# Altium project MMC_2_4.PrjPcb
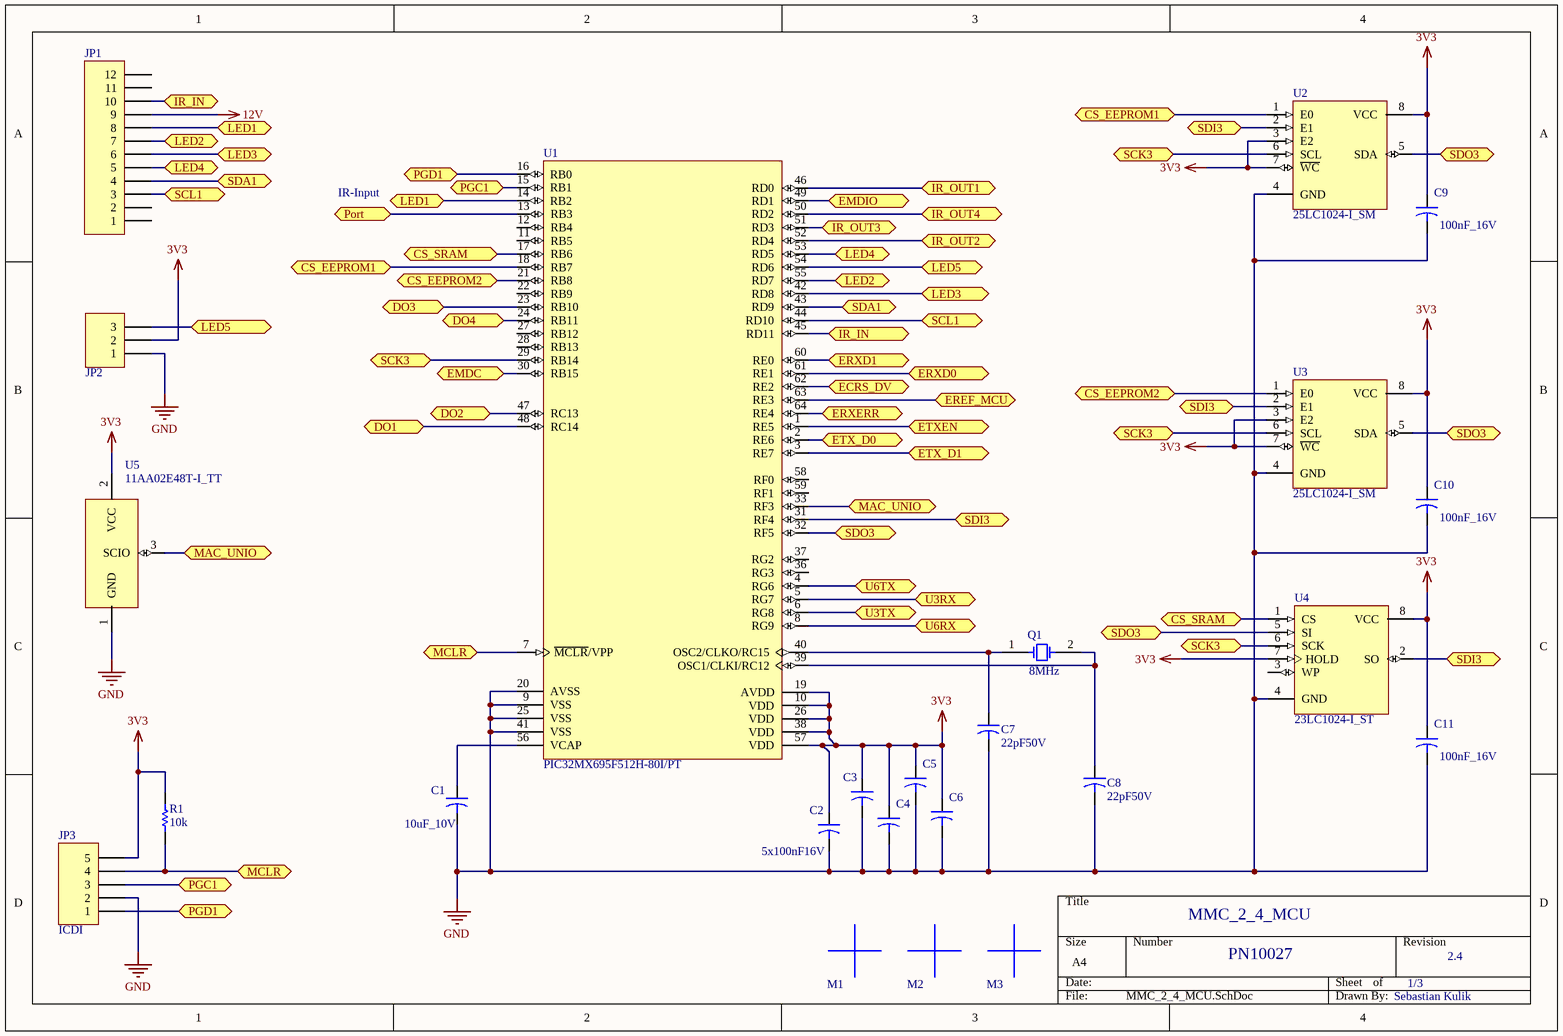
[diagram p0: MMC_2_4_MCU.SchDoc]
3 sheets, 99 parts. Net scope: flat (ports and power ports of the same name join across sheets).
Board file: MMC_2_4.PcbDoc
Sheets:
  MMC_2_4_MCU.SchDoc
  MMC_2_4_Ethernet.SchDoc
  MMC_2_4_PSU.SchDoc

## Sheet MMC_2_4_MCU.SchDoc
size A4

### Parts
C1  value 10uF_10V  [C0603]  (hidden comment: 10uF10V_0603)
C2  100nF16V_0402  [C0402]  (value not drawn)
C3  100nF16V_0402  [C0402]  (value not drawn)
C4  100nF16V_0402  [C0402]  (value not drawn)
C5  100nF16V_0402  [C0402]  (value not drawn)
C6  100nF16V_0402  [C0402]  (value not drawn)
C7  value 22pF50V  [C0402]  (hidden comment: 22pF50V_0402-AVX)
C8  value 22pF50V  [C0402]  (hidden comment: 22pF50V_0402-AVX)
C9  value 100nF_16V  [C0402]  (hidden comment: 100nF16V_0402)
C10  value 100nF_16V  [C0402]  (hidden comment: 100nF16V_0402)
C11  value 100nF_16V  [C0402]  (hidden comment: 100nF16V_0402)
JP1  Plug_12_2.54  [HDR1X12_2.54]  (value not drawn)
JP2  Header-3  [HDR1X3]  (value not drawn)
JP3  ICDI  [HDR1X5-1.27]
M1  Paste Mark  [Mark-3mm]  (value not drawn)
M2  Paste Mark  [Mark-3mm]  (value not drawn)
M3  Paste Mark  [Mark-3mm]  (value not drawn)
Q1  value 8MHz  [TXC_7A]  (hidden comment: Crystal_8MHz)
R1  value 10k  [R0402]  (hidden comment: 10k_0402)
U1  PIC32MX695F512H-80I/PT  [TQFP-64_N1]
U2  25LC1024-I_SM  [SOP8_N]
U3  25LC1024-I_SM  [SOP8_N]
U4  23LC1024-I_ST  [TSSOP8]
U5  11AA02E48T-I_TT  [SOT23_M]

### Ports
CS_EEPROM1, CS_EEPROM2, CS_SRAM, DO1, DO2, DO3, DO4, ECRS_DV, EMDC, EMDIO, EREF_MCU, ERXD0, ERXD1, ERXERR, ETX_D0, ETX_D1, ETXEN, IR_IN, IR_OUT1, IR_OUT2, IR_OUT3, IR_OUT4, LED1, LED2, LED3, LED4, LED5, MAC_UNIO, MCLR, PGC1, PGD1, Port, SCK3, SCL1, SDA1, SDI3, SDO3, U3RX, U3TX, U6RX, U6TX

### Nets
3V3: C2.1 C3.1 C4.1 C5.1 C6.1 C9.1 C10.1 C11.1 JP2.2 JP3.5 R1.2 U1.10(VDD) U1.19(AVDD) U1.26(VDD) U1.38(VDD) U1.57(VDD) U2.3(E2) U2.7(~{WC}) U2.8(VCC) U3.3(E2) U3.7(~{WC}) U3.8(VCC) U4.7(HOLD) U4.8(VCC) U5.2(VCC)
12V: JP1.9
GND: C1.2 C2.2 C3.2 C4.2 C5.2 C6.2 C7.2 C8.2 C9.2 C10.2 C11.2 JP2.1 JP3.2 U1.9(VSS) U1.20(AVSS) U1.25(VSS) U1.41(VSS) U2.4(GND) U3.4(GND) U4.4(GND) U5.1(GND)
NetC1_1: C1.1 U1.56(VCAP)
NetC7_1: C7.1 Q1.1 U1.40(OSC2/CLKO/RC15)
NetC8_1: C8.1 Q1.2 U1.39(OSC1/CLKI/RC12)
NetJP1_3: JP1.3 U1.44(RD10) ; port SCL1
NetJP1_4: JP1.4 U1.43(RD9) ; port SDA1
NetJP1_5: JP1.5 U1.53(RD5) ; port LED4
NetJP1_6: JP1.6 U1.42(RD8) ; port LED3
NetJP1_7: JP1.7 U1.55(RD7) ; port LED2
NetJP1_8: JP1.8 U1.14(RB2) ; port LED1
NetJP1_10: JP1.10 U1.45(RD11) ; port IR_IN
NetJP2_3: JP2.3 U1.54(RD6) ; port LED5
NetJP3_1: JP3.1 U1.16(RB0) ; port PGD1
NetJP3_3: JP3.3 U1.15(RB1) ; port PGC1
NetJP3_4: JP3.4 R1.1 U1.7(~{MCLR}/VPP) ; port MCLR
NetL5_2: U1.63(RE3) ; port EREF_MCU
NetR13_1: U1.49(RD1) ; port EMDIO
NetR15_2: U1.60(RE0) ; port ERXD1
NetR16_2: U1.61(RE1) ; port ERXD0
NetR17_2: U1.64(RE4) ; port ERXERR
NetR18_2: U1.62(RE2) ; port ECRS_DV
NetU1_1: U1.1(RE5) ; port ETXEN
NetU1_2: U1.2(RE6) ; port ETX_D0
NetU1_3: U1.3(RE7) ; port ETX_D1
NetU1_4: U1.4(RG6) ; port U6TX
NetU1_5: U1.5(RG7) ; port U3RX
NetU1_6: U1.6(RG8) ; port U3TX
NetU1_8: U1.8(RG9) ; port U6RX
NetU1_13: U1.13(RB3) ; port Port
NetU1_17: U1.17(RB6) U4.1(CS) ; port CS_SRAM
NetU1_18: U1.18(RB7) U2.1(E0) ; port CS_EEPROM1
NetU1_21: U1.21(RB8) U3.1(E0) ; port CS_EEPROM2
NetU1_23: U1.23(RB10) ; port DO3
NetU1_24: U1.24(RB11) ; port DO4
NetU1_29: U1.29(RB14) U2.6(SCL) U3.6(SCL) U4.6(SCK) ; port SCK3
NetU1_30: U1.30(RB15) ; port EMDC
NetU1_31: U1.31(RF4) U2.2(E1) U3.2(E1) U4.2(SO) ; port SDI3
NetU1_32: U1.32(RF5) U2.5(SDA) U3.5(SDA) U4.5(SI) ; port SDO3
NetU1_33: U1.33(RF3) U5.3(SCIO) ; port MAC_UNIO
NetU1_46: U1.46(RD0) ; port IR_OUT1
NetU1_47: U1.47(RC13) ; port DO2
NetU1_48: U1.48(RC14) ; port DO1
NetU1_50: U1.50(RD2) ; port IR_OUT4
NetU1_51: U1.51(RD3) ; port IR_OUT3
NetU1_52: U1.52(RD4) ; port IR_OUT2

Not connected (* = marked no-connect by the designer): JP1 1 2 11 12; U1 11(RB5) 12(RB4) 22(RB9) 27(RB12) 28(RB13) 36(RG3) 37(RG2) 58(RF0) 59(RF1); U4 3(WP)

### Notes on the sheet
- IR-Input
- (near C2) 5x100nF16V
- MMC_2_4_MCU
- PN10027
- 1/3
- 2.4
- Sebastian Kulik

### Library data of the parts
C1 = 10uF10V_0603: AVX ,  X5R, 20%, 10V; Deliverer PartNr: 1867954RL; Manufacturer PartNr: 0603ZD106MAT2A; Deliverer: Farnell; TDE-PN: C0016; Published: 11.02.2014; Part Description: AVX ,  X5R, 20%, 10V; Publisher: Sebastian Kulik; PackageDescription: C0603; Manufacturer: AVX
C2-C6 = 100nF16V_0402: TDK. CGA series, X7R, 10%, 16V; Deliverer PartNr: 2366533; Manufacturer: TDK; Manufacturer PartNr: CGA2B1X7R1C104K050BC; Deliverer: Farnell; Value: 100nF_16V; TDE-PN: C0025; Published: 12.02.2014; Part Description: TDK. CGA series, X7R, 10%, 16V; Publisher: Sebastian Kulik; PackageDescription: C0402
C7 C8 = 22pF50V_0402-AVX: AVX, 50V; Deliverer PartNr: 2332500; Manufacturer PartNr: 04025A220FAT2A; Deliverer: Farnell; TDE-PN: C0021; Published: 22.10.2014; Part Description: AVX, 50V; Publisher: Sebastian Kulik; PackageDescription: C0402; Manufacturer: AVX
C9-C11 = 100nF16V_0402: TDK. CGA series, X7R, 10%, 16V; Deliverer PartNr: 2366533; Manufacturer: TDK; Manufacturer PartNr: CGA2B1X7R1C104K050BC; Deliverer: Farnell; TDE-PN: C0025; Published: 12.02.2014; Part Description: TDK. CGA series, X7R, 10%, 16V; Publisher: Sebastian Kulik; PackageDescription: C0402
JP1 = Plug_12_2.54: Plug, 11-Pin; Manufacturer PartNr: 61301211121; Manufacturer: WE; TDE-PN: CON0018; LatestRevisionDate: 27.05.2014; LatestRevisionNote: Re-released for DXP Platform.; Publisher: Sebastian Kulik; Deliverer: WE; Deliverer PartNr: 61301211121
JP2 = Header-3: Header-3-Pin; Publisher: Sebastian Kulik
JP3 = ICDI: Header, 5-Pin; LatestRevisionDate: 17-Jul-2002; LatestRevisionNote: Re-released for DXP Platform.; Publisher: Sebastian Kulik; PackageDescription: HDR1X1.27
M1-M3 = Mark: Comment_1: PasteMark
Q1 = Crystal_8MHz: Crystal, 7A-8.000MAAJ-T; Deliverer PartNr: 1892148; Manufacturer: TXC; Deliverer: Farnell; TDE-PN: P0003; Published: 14.02.2014; Publisher: Sebastian Kulik; Manufacturer PartNr: 7A-8.000MAAJ-T; PackageDescription: TXC_7A
R1 = 10k_0402: Vishay CRCW series, 125mW, 1%; Manufacturer PartNr: CRCW040210K0FKEAHP; Deliverer PartNr: 1738864; TDE-PN: R0012; Deliverer: Farnell; Published: 12.02.2014; Publisher: Sebastian Kulik; PackageDescription: 0402; Manufacturer: Vishay; Part Description: Vishay CRCW series, 125mW, 1%
U1 = PIC32MX695F512H-80I/PT: High Performance ROM-less Microcontroller with External Memory Bus, 1.5K RAM, 64-Pin TQFP, 4.2 to 5.5V Supply Range, Industrial Temperature; Deliverer PartNr: 1778975; Manufacturer: Microchip; Deliverer: Farnell; TDE-PN: IC0031; Published: 11.02.2014; PackageReference: TQFP-64; Publisher: Sebastian Kulik; PackageDescription: 64-Pin Thin Plastic Quad Flat Pack 0.5 mm Pitch, 1.0/0.1 mm Lead Form; Manufacturer PartNr: PIC32MX695F512H-80I/PT
U2 U3 = 25LC1024-I_SM: 1024 Kbit Serial SPI Bus EEPROM; Deliverer PartNr: 1331393; Manufacturer: Microchip; Deliverer: Farnell; TDE-PN: IC0033; Published: 12.02.2014; Publisher: Sebastian Kulik; Manufacturer PartNr: 25LC1024-I_SM; PackageDescription: SOP8
U4 = 23LC1024-I_ST: 1 Mbit Serial  EEPROM; Deliverer PartNr: 2212151; Manufacturer PartNr: 23LC1024-I/ST; Manufacturer: Microchip; Deliverer: Farnell; TDE-PN: IC0034; Published: 12.02.2014; Publisher: Sebastian Kulik; PackageDescription: TSSOP8
U5 = 11AA02E48T-I_TT: 2 kbit Serial  EEPROM; Deliverer PartNr: 1707616RL; Manufacturer PartNr: 11AA02E48T-I/TT; Manufacturer: Microchip; Deliverer: Farnell; TDE-PN: IC0035; Published: 12.02.2014; Publisher: Sebastian Kulik; PackageDescription: SOT23

## Sheet MMC_2_4_Ethernet.SchDoc
size A4
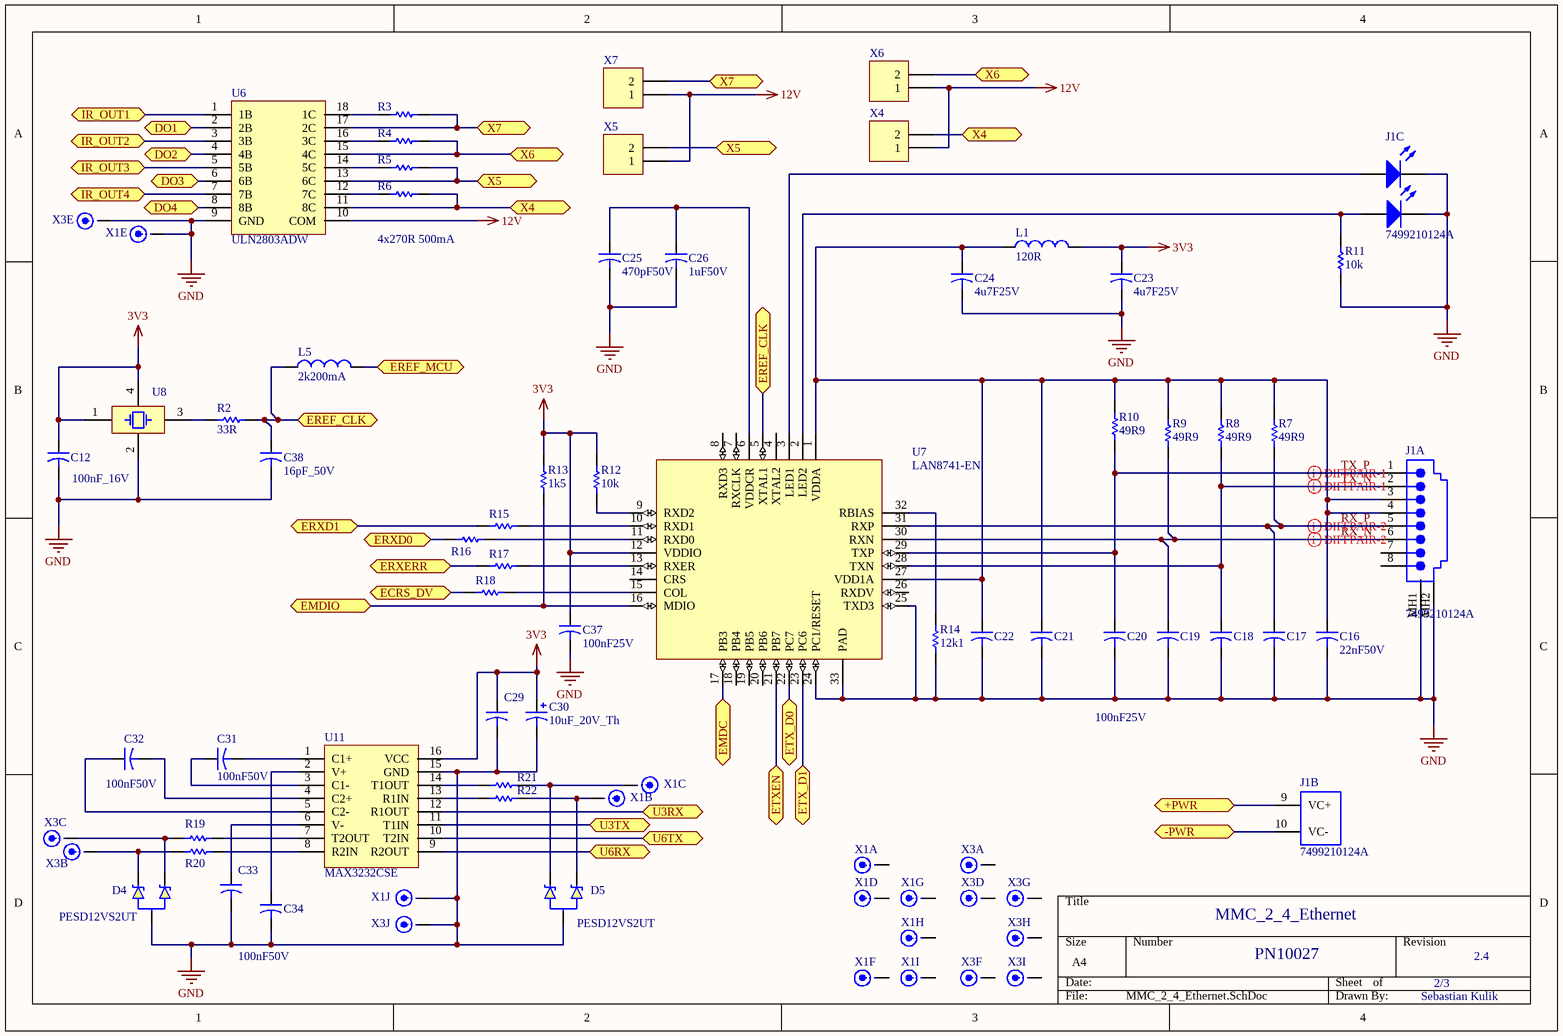
[diagram p1: MMC_2_4_Ethernet.SchDoc]

### Parts
C12  value 100nF_16V  [C0402]  (hidden comment: 100nF16V_0402)
C16  value 22nF50V  [C0603]  (hidden comment: 22nF50V_0603)
C17  10pF50V_0603  [C0603]  (value not drawn)
C18  10pF50V_0603  [C0603]  (value not drawn)
C19  10pF50V_0603  [C0603]  (value not drawn)
C20  10pF50V_0603  [C0603]  (value not drawn)
C21  value 100nF25V  [C0402]  (hidden comment: 100nF25V_0402)
C22  100nF25V_0402  [C0402]  (value not drawn)
C23  value 4u7F25V  [C0805]  (hidden comment: 4u7F25V_0805)
C24  value 4u7F25V  [C0805]  (hidden comment: 4u7F25V_0805)
C25  value 470pF50V  [C0402]  (hidden comment: 470pF50V_0402)
C26  value 1uF50V  [C0603]  (hidden comment: 1uF50V_0603)
C29  100nF25V_0402  [C0402]  (value not drawn)
C30  value 10uF_20V_Th  [Vishay293D-B]  (hidden comment: 10uF_20V_V293D-B)
C31  value 100nF50V  [C0402]  (hidden comment: 100n50V_0402)
C32  value 100nF50V  [C0402]  (hidden comment: 100n50V_0402)
C33  100n50V_0402  [C0402]  (value not drawn)
C34  value 100nF50V  [C0402]  (hidden comment: 100n50V_0402)
C37  value 100nF25V  [C0402]  (hidden comment: 100nF25V_0402)
C38  value 16pF_50V  [C0402]  (hidden comment: 16pF50V_0402)
D4  PESD12VS2UT  [SOT23_N]
D5  PESD12VS2UT  [SOT23_N]
J1  7499210124A  [7499210124A]  (parts A,B,C of 3)
L1  value 120R  [L0603]  (hidden comment: 120R4A_0603)
L5  value 2k200mA  [L0805_M]  (hidden comment: 2k200mA_0805)
R2  value 33R  [R0402]  (hidden comment: 33R_0402)
R3  270R_1210  [R1210_N]  (value not drawn)
R4  270R_1210  [R1210_N]  (value not drawn)
R5  270R_1210  [R1210_N]  (value not drawn)
R6  270R_1210  [R1210_N]  (value not drawn)
R7  value 49R9  [R0402]  (hidden comment: 49R9_0402)
R8  value 49R9  [R0402]  (hidden comment: 49R9_0402)
R9  value 49R9  [R0402]  (hidden comment: 49R9_0402)
R10  value 49R9  [R0402]  (hidden comment: 49R9_0402)
R11  value 10k  [R0402]  (hidden comment: 10k_0402)
R12  value 10k  [R0402]  (hidden comment: 10k_0402)
R13  value 1k5  [R0402]  (hidden comment: 1k5_0402)
R14  value 12k1  [R0603(1608)]  (hidden comment: 12k1_0603)
R15  10R_0402  [R0402]  (value not drawn)
R16  10R_0402  [R0402]  (value not drawn)
R17  10R_0402  [R0402]  (value not drawn)
R18  10R_0402  [R0402]  (value not drawn)
R19  10R_0402  [R0402]  (value not drawn)
R20  10R_0402  [R0402]  (value not drawn)
R21  10R_0402  [R0402]  (value not drawn)
R22  10R_0402  [R0402]  (value not drawn)
U6  ULN2803ADW  [SOIC18-WIDE]
U7  LAN8741-EN  [32M1-A_M]
U8  SG - 211 S*E -50.000M  [SG - 211 S*E]  (value not drawn)
U11  MAX3232CSE  [SOIC16_L]
X1  SUB-D_9  [M09HP]  (value not drawn)  (parts A,B,C,D,E,F,G,H,I,J of 10)
X3  SUB-D_9  [M09HP]  (value not drawn)  (parts A,B,C,D,E,F,G,H,I,J of 10)
X4  WR-TBL3127  [WR-TBL-3127]  (value not drawn)
X5  WR-TBL3127  [WR-TBL-3127]  (value not drawn)
X6  WR-TBL3127  [WR-TBL-3127]  (value not drawn)
X7  WR-TBL3127  [WR-TBL-3127]  (value not drawn)

### Ports
+PWR, -PWR, DO1, DO2, DO3, DO4, ECRS_DV, EMDC, EMDIO, EREF_CLK, EREF_MCU, ERXD0, ERXD1, ERXERR, ETX_D0, ETX_D1, ETXEN, IR_OUT1, IR_OUT2, IR_OUT3, IR_OUT4, U3RX, U3TX, U6RX, U6TX, X4, X5, X6, X7

### Nets
3V3: C12.1 C23.1 C29.1 C30.1 C37.1 L1.2 R12.2 R13.2 U7.12(VDDIO) U8.1(E/D) U8.4(VCC) U11.16(VCC)
12V: U6.10(COM) X4.1 X5.1 X6.1 X7.1
GND: C12.2 C16.2 C17.2 C18.2 C19.2 C20.2 C21.2 C22.2 C23.2 C24.2 C25.2 C26.2 C29.2 C30.2 C33.2 C34.2 C37.2 C38.2 D4.1(A) D5.1(A) J1.11(K) J1.13(K) J1.MH1(Shield) J1.MH2(Shield) R11.1 R14.1 U6.9(GND) U7.24(PC1/RESET) U7.25(TXD3) U7.33(PAD) U8.2(GND) U11.15(GND) X1.5 X1.10(GND) X3.5 X3.10(GND)
RX_N: C19.1 J1.6 R9.1 U7.30(RXN)
RX_P: C17.1 J1.5 R7.1 U7.31(RXP)
TX_N: C18.1 J1.2 R8.1 U7.28(TXN)
TX_P: C20.1 J1.1 R10.1 U7.29(TXP)
NetC16_1: C16.1 C21.1 C22.1 C24.1 J1.3 J1.4 L1.1 R7.2 R8.2 R9.2 R10.2 U7.1(VDDA) U7.27(VDD1A)
NetC25_1: C25.1 C26.1 U7.6(VDDCR)
NetC31_1: C31.1 U11.3(C1-)
NetC31_2: C31.2 U11.1(C1+)
NetC32_1: C32.1 U11.5(C2-)
NetC32_2: C32.2 U11.4(C2+)
NetC33_1: C33.1 U11.6(V-)
NetC34_1: C34.1 U11.2(V+)
NetC38_1: C38.1 L5.1 R2.2 U7.5(XTAL1) ; port EREF_CLK
NetD4_2: D4.2(K2) R20.1 X3.2
NetD4_3: D4.3(K1) R19.1 X3.3
NetD5_2: D5.2(K2) R21.2 X1.3
NetD5_3: D5.3(K1) R22.2 X1.2
NetJ1_9: J1.9(VC+) ; port +PWR
NetJ1_10: J1.10(VC-) ; port -PWR
NetJ1_12: J1.12(A) U7.3(LED1)
NetJ1_14: J1.14(A) R11.2 U7.2(LED2)
NetL5_2: L5.2 ; port EREF_MCU
NetR2_1: R2.1 U8.3(OSC2)
NetR3_1: R3.1 U6.18(1C)
NetR3_2: R3.2 U6.17(2C) X7.2 ; port X7
NetR4_1: R4.1 U6.16(3C)
NetR4_2: R4.2 U6.15(4C) X6.2 ; port X6
NetR5_1: R5.1 U6.14(5C)
NetR5_2: R5.2 U6.13(6C) X5.2 ; port X5
NetR6_1: R6.1 U6.12(7C)
NetR6_2: R6.2 U6.11(8C) X4.2 ; port X4
NetR12_1: R12.1 U7.9(RXD2)
NetR13_1: R13.1 U7.16(MDIO) ; port EMDIO
NetR14_2: R14.2 U7.32(RBIAS)
NetR15_1: R15.1 U7.10(RXD1)
NetR15_2: R15.2 ; port ERXD1
NetR16_1: R16.1 U7.11(RXD0)
NetR16_2: R16.2 ; port ERXD0
NetR17_1: R17.1 U7.13(RXER)
NetR17_2: R17.2 ; port ERXERR
NetR18_1: R18.1 U7.15(COL)
NetR18_2: R18.2 ; port ECRS_DV
NetR19_2: R19.2 U11.7(T2OUT)
NetR20_2: R20.2 U11.8(R2IN)
NetR21_1: R21.1 U11.14(T1OUT)
NetR22_1: R22.1 U11.13(R1IN)
NetU1_1: U7.21(PB7) ; port ETXEN
NetU1_2: U7.22(PC7) ; port ETX_D0
NetU1_3: U7.23(PC6) ; port ETX_D1
NetU1_4: U11.10(T2IN) ; port U6TX
NetU1_5: U11.12(R1OUT) ; port U3RX
NetU1_6: U11.11(T1IN) ; port U3TX
NetU1_8: U11.9(R2OUT) ; port U6RX
NetU1_23: U6.6(6B) ; port DO3
NetU1_24: U6.8(8B) ; port DO4
NetU1_30: U7.17(PB3) ; port EMDC
NetU1_46: U6.1(1B) ; port IR_OUT1
NetU1_47: U6.4(4B) ; port DO2
NetU1_48: U6.2(2B) ; port DO1
NetU1_50: U6.7(7B) ; port IR_OUT4
NetU1_51: U6.5(5B) ; port IR_OUT3
NetU1_52: U6.3(3B) ; port IR_OUT2

Not connected (* = marked no-connect by the designer): J1 7 8; U7 4(XTAL2) 7(RXCLK) 8(RXD3) 14(CRS) 18(PB4) 19(PB5) 20(PB6) 26(RXDV); X1 1 4 6 7 8 9; X3 1 4 6 7 8 9

### Layout directives
differential pair: RX_N, RX_P, TX_N, TX_P

### Notes on the sheet
- 4x270R 500mA
- MMC_2_4_Ethernet
- PN10027
- 2/3
- 2.4
- Sebastian Kulik

### Library data of the parts
C12 = 100nF16V_0402: as C9 on sheet MMC_2_4_MCU; Published: 12.02.2014; Part Description: TDK. CGA series, X7R, 10%, 16V; Publisher: Sebastian Kulik; PackageDescription: C0402
C16 = 22nF50V_0603: AVX ,  X7R, 5%, 50V; Deliverer PartNr: 1835412; Manufacturer PartNr: 06035C223JAT2A; Deliverer: Farnell; TDE-PN: C0034; Published: 13.02.2014; Part Description: AVX ,  X7R, 5%, 50V; Publisher: Sebastian Kulik; PackageDescription: C0603; Manufacturer: AVX
C17-C20 = 10pF50V_0603: AVX ,  +-0.5pF, 50V; Deliverer PartNr: 2332595RL; Manufacturer PartNr: 06035A100DAT2A; Deliverer: Farnell; TDE-PN: C0033; Published: 13.02.2014; Part Description: AVX ,  +-0.5pF, 50V; Publisher: Sebastian Kulik; PackageDescription: C0603; Manufacturer: AVX; Value: 10pF50V
C21 C22 C29 C37 = 100nF25V_0402: AVX, X5R, 10%, 25V; Deliverer PartNr: 1833862; Manufacturer PartNr: 04023D104KAT2A; Deliverer: Farnell; TDE-PN: C0036; Published: 09.12.2014; Part Description: AVX, X5R, 10%, 25V; Publisher: Sebastian Kulik; PackageDescription: C0402; Manufacturer: AVX
  C22 C29: Value: 100nF25V
C23 C24 = 4u7F25V_0805: TDK  C series, X7R, 10%, 25V; Deliverer PartNr: 2346943RL; Manufacturer PartNr: C2012X7R1E475K125AB; Deliverer: Farnell; TDE-PN: C0035; Published: 13.02.2014; Part Description: TDK  C series, X7R, 10%, 25V; Publisher: Sebastian Kulik; PackageDescription: C0805; Manufacturer: TDK
C25 = 470pF50V_0402: AVX, 50V; Deliverer PartNr: 1657927; Manufacturer PartNr: 04025A471JAT2A; Deliverer: Farnell; TDE-PN: C0030; Published: 13.02.2014; Part Description: AVX,50V; Publisher: Sebastian Kulik; PackageDescription: C0402; Manufacturer: AVX
C26 = 1uF50V_0603: C series, X5R, 10%; Deliverer PartNr: 2211179RL; Manufacturer: TDK; Manufacturer PartNr: C1608X5R1H105K080AB; Deliverer: Farnell; TDE-PN: C0037; Published: 13.02.2014; Part Description: C series, X5R, 10%; Publisher: Sebastian Kulik; PackageDescription: C0603
C30 = 10uF_20V_V293D-B: 293 series, tantal, 10%, 10V; Part Description: 293 series, tantal, 10%, 20V; Deliverer PartNr: 1754203; Manufacturer: Vishay; Manufacturer PartNr: 293D106X9020B2TE3; Deliverer: Farnell; TDE-PN: C0043; Published: 14.03.2014; Publisher: Sebastian Kulik; PackageDescription: Vishay-293D-B
C31 C32 C34 = 100n50V_0402: C series, X5R, 10%, 50V; Part Description: GRM series, X5R, 10%, 50V; Deliverer PartNr: 2218856; Manufacturer: Murata; Manufacturer PartNr: GRM155R61H104KE19D; Deliverer: Farnell; TDE-PN: C0044; Published: 13.02.2014; Publisher: Sebastian Kulik; PackageDescription: C0402
C33 = 100n50V_0402: C series, X5R, 10%, 50V; Part Description: GRM series, X5R, 10%, 50V; Deliverer PartNr: 2218856; Manufacturer: Murata; Manufacturer PartNr: GRM155R61H104KE19D; Deliverer: Farnell; Value: 100nF50V; TDE-PN: C0044; Published: 13.02.2014; Publisher: Sebastian Kulik; PackageDescription: C0402
C38 = 16pF50V_0402: C series, 5%, 50V; Deliverer PartNr: 1865423; Manufacturer: Kemet; Manufacturer PartNr: C0402C160J5GACTU; Deliverer: Farnell; TDE-PN: C0020; Published: 11.03.2014; Part Description: C series, 5%, 50V; Publisher: Sebastian Kulik; PackageDescription: C0402
D4 D5 = PESD12VS2UT: EDS diode(s); Deliverer PartNr: 8737401; Manufacturer: NXP; TDE-PN: DIS0035; Deliverer: Farnell; Published: 05.12.2014; Publisher: Sebastian Kulik; PackageDescription: SOT23; Manufacturer PartNr: PESD12VS2UT
J1 = Ethernet, POE, WE7499210124A: Modular Jack , Right Angle RJ-45, Low Profile; Manufacturer: Wuerth Elektronik; Ports: 1; PCB_Mounting: Thru-Hole; Deliverer: WE; TDE-PN: CON0013; Publisher: Sebastian Kulik; Deliverer PartNr: 7499210124A; Manufacturer PartNr: 7499210124A; PackageDescription: 7499210124A
L1 = 120R4A_0603: Murata, Ferrit, 120Rx2A; Deliverer PartNr: 1515738RL; Manufacturer PartNr: BLM18PG121SN1D; Deliverer: Farnell; TDE-PN: P0016; Manufacturer: Murata; Published: 13.02.2014; Publisher: Sebastian Kulik; PackageDescription: L0603
L5 = 2k200mA_0805: Ferrit, 2k, 200mA; Deliverer PartNr: 742792092; Deliverer: WE; TDE-PN: P0037; Manufacturer: WE; Manufacturer PartNr: 742792092; Published: 09.03.2015; Publisher: Sebastian Kulik; PackageDescription: L0805_M
R2 = 33R_0402: Vishay CRCW series, 63mW, 1%; Manufacturer PartNr: CRCW040233R0FKEAHP; Deliverer PartNr: 1738830; TDE-PN: R0037; Deliverer: Farnell; Published: 12.02.2014; Publisher: Sebastian Kulik; PackageDescription: 0402; Manufacturer: Vishay; Part Description: Vishay CRCW series, 63mW, 1%
R3-R6 = 270R_1210: ERJ series, 500mW, 5%; Manufacturer: Panasonic; Manufacturer PartNr: ERJ14YJ271U; Deliverer PartNr: 2324044; TDE-PN: R0042; Deliverer: Farnell; Value: 270R; Published: 13.03.2014; Publisher: Sebastian Kulik; PackageDescription: 1210; Part Description: ERJ series, 500mW, 5%
R7-R10 = 49R9_0402: Vishay CRCW series, 63mW, 1%; Manufacturer PartNr: CRCW040249R9FKED; Deliverer PartNr: 2121437; TDE-PN: R0035; Deliverer: Farnell; Published: 13.02.2014; Publisher: Sebastian Kulik; PackageDescription: 0402; Manufacturer: Vishay; Part Description: Vishay CRCW series, 63mW, 1%
R11 R12 = 10k_0402: as R1 on sheet MMC_2_4_MCU; Published: 12.02.2014; Publisher: Sebastian Kulik; PackageDescription: 0402; Manufacturer: Vishay; Part Description: Vishay CRCW series, 125mW, 1%
R13 = 1k5_0402: Vishay CRCW series, 125mW, 1%; Manufacturer PartNr: CRCW04021K50FKEAHP; Deliverer PartNr: 1738852; Part Description: Vishay CRCW series, 63mW, 1%; TDE-PN: R0036; Deliverer: Farnell; Published: 13.02.2014; Publisher: Sebastian Kulik; PackageDescription: 0402; Manufacturer: Vishay
R14 = 12k1_0603: Vishay, CRCW series, 100mW, 1%; Manufacturer PartNr: CRCW060312K1FKEA; Deliverer PartNr: 2122502; TDE-PN: R0037; Deliverer: Farnell; Published: 11.02.2014; Publisher: Sebastian Kulik; PackageDescription: 0603; Manufacturer: Vishay; Part Desicription: Vishay, CRCW series, 100mW, 1%
R15-R22 = 10R_0402: Vishay CRCW series, 125mW, 1%; Manufacturer PartNr: CRCW040210R0FKEAHP; Deliverer PartNr: 1738824RL; TDE-PN: R0015; Deliverer: Farnell; Value: 10R; Published: 12.02.2014; Publisher: Sebastian Kulik; PackageDescription: 0402; Manufacturer: Vishay; Part Description: Vishay CRCW series, 125mW, 1%
U6 = ULN2803ADW: Darlington array, 50V; Deliverer PartNr: 1652419; Manufacturer: TI; Deliverer: Farnell; TDE-PN: IC0043; Published: 13.03.2014; Publisher: Sebastian Kulik; Manufacturer PartNr: ULN2803ADW; PackageDescription: SOIC18-WIDE
U7 = LAN8741-EN: Ethernet Phy; Deliverer PartNr: 2373284; Manufacturer: Microchip; TDE-PN: IC0036; Deliverer: Farnell; Published: 12.02.2014; LatestRevisionNote: IPC-7351 Footprint Added.; Publisher: Sebastian Kulik; Manufacturer PartNr: LAN8741-EN; PackageDescription: 32M1-A-L/M/N
U8 = SG - 211 S*E -50.000M: Crystal; Deliverer PartNr: 2405766RL; Manufacturer PartNr: X1G0036210074; Manufacturer: Epson; Deliverer: Farnell; TDE-PN: IC0050; Published: 26.05.2014; Publisher: Sebastian Kulik; PackageDescription: SG-221 S*E
U11 = MAX3232CSE: RS232 transceiver; Deliverer PartNr: 9725490; Manufacturer PartNr: MAX3232CSE+; Manufacturer: Maxim; Deliverer: Farnell; TDE-PN: IC0044; Published: 14.03.2014; Publisher: Sebastian Kulik; PackageDescription: SOIC16_L
X1 X3 = SUB-D_9: Deliverer PartNr: 1-1634580-2; Manufacturer: AMP; Deliverer: Arrow; TDE-PN: CON0007; LatestRevisionDate: 14.03.2014; LatestRevisionNote: Re-released for DXP Platform.; Publisher: Sebastian Kulik; Manufacturer PartNr: 1-1634580-2; PackageDescription: M09HP
X4-X7 = Header-2-WR-TBL3127: Header 2 pin, horizontal,WR-TBL3127; Deliverer PartNr: 1841288; Manufacturer: WE; Manufacturer PartNr: 691312710002; Deliverer: Farnell; TDE-PN: CON0014; LatestRevisionDate: 28.05.2014; LatestRevisionNote: Re-released for DXP Platform.; Publisher: Sebastian Kulik; PackageDescription: WR-TBL-3127

## Sheet MMC_2_4_PSU.SchDoc
size A4
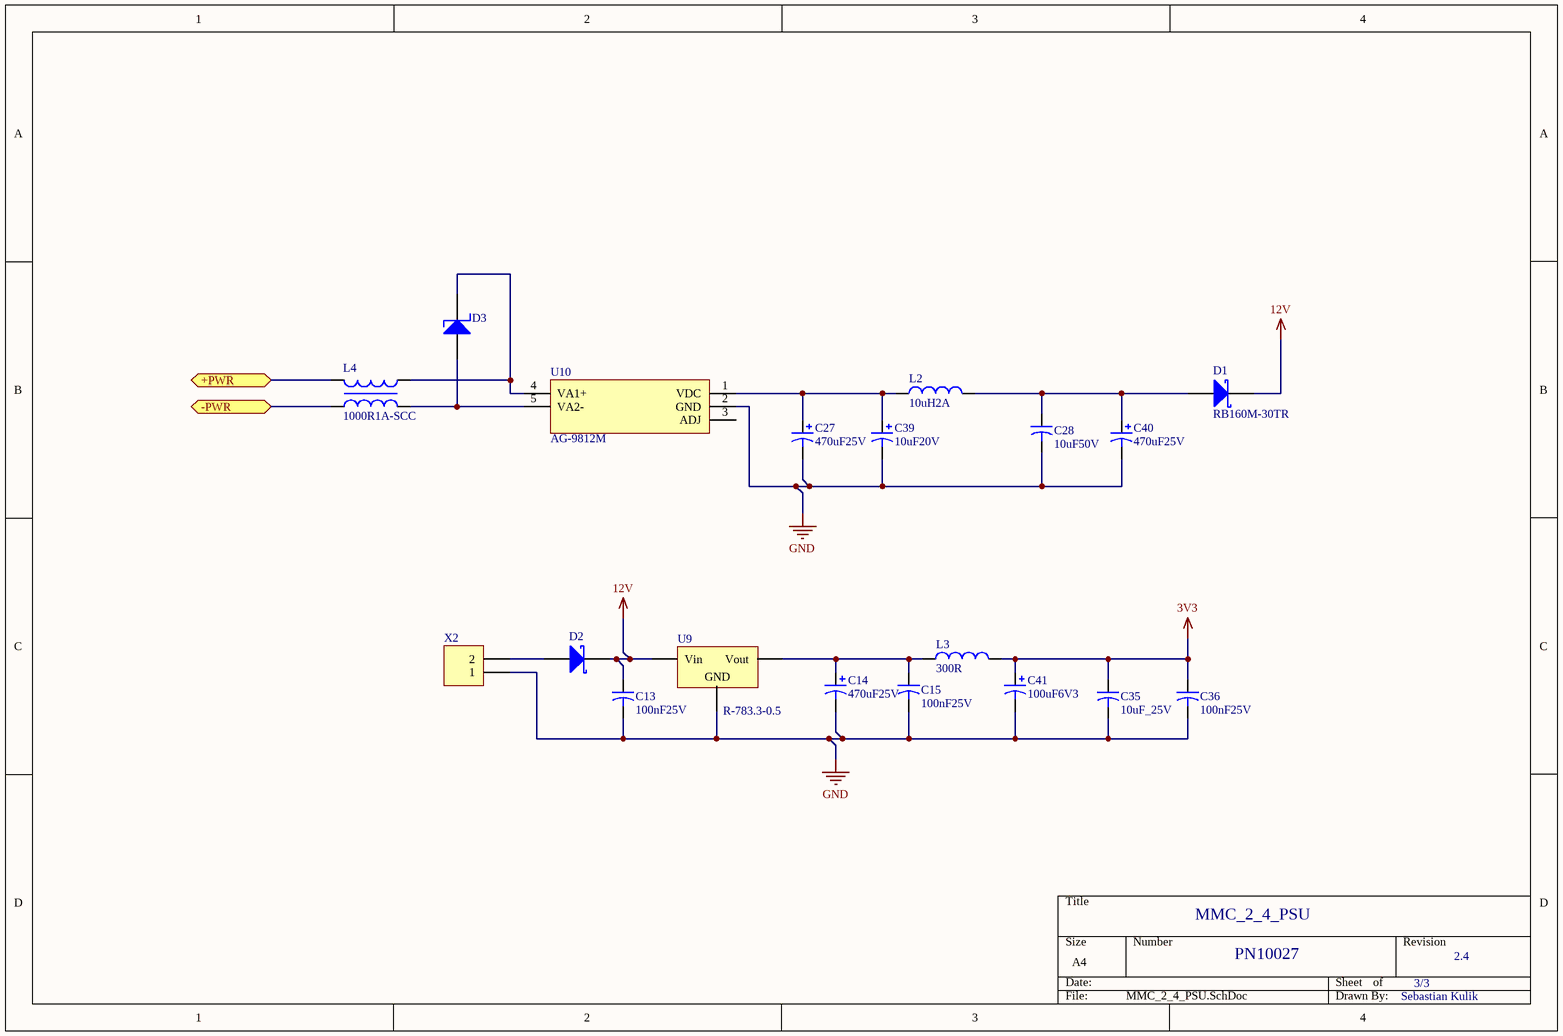
[diagram p2: MMC_2_4_PSU.SchDoc]

### Parts
C13  value 100nF25V  [C0402]  (hidden comment: 100nF25V_0402)
C14  value 470uF25V  [Panasonic-FT-F_Case]  (hidden comment: 470uF25V_POL_FT)
C15  value 100nF25V  [C0402]  (hidden comment: 100nF25V_0402)
C27  value 470uF25V  [Panasonic-FT-F_Case]  (hidden comment: 470uF25V_POL_FT)
C28  value 10uF50V  [C1210]  (hidden comment: 10uF50V_1210)
C35  value 10uF_25V  [C1210]  (hidden comment: 10uF25V_1210)
C36  value 100nF25V  [C0402]  (hidden comment: 100nF25V_0402)
C39  value 10uF20V  [Vishay293D-B]  (hidden comment: 10uF_20V_V293D-B)
C40  value 470uF25V  [Panasonic-FT-F_Case]  (hidden comment: 470uF25V_POL_FT)
C41  value 100uF6V3  [Vishay293D-B]  (hidden comment: 100uF_6V3_V293D-B)
D1  RB160M-30TR  [SOD123]
D2  RB160M-30TR  [SOD123]  (value not drawn)
D3  SMAJ58A-E3/61  [DO214A]  (value not drawn)
L2  10uH2A  [WE-PD2_1]
L3  value 300R  [L0603]  (hidden comment: 300R2A_0603)
L4  1000R1A-SCC  [WE-SCC_7345]
U9  R-783.3-0.5  [R-783_3-0_5]
U10  AG-9812M  [Ag9812M]
X2  WR-TBL3127  [WR-TBL-3127]  (value not drawn)

### Ports
+PWR, -PWR

### Nets
3V3: C35.1 C36.1 C41.1 L3.2
12V: C13.1 D1.1(K) D2.1(K) U9.1(Vin)
GND: C13.2 C14.2 C15.2 C27.2 C28.2 C35.2 C36.2 C39.2 C40.2 C41.2 U9.2(GND) U10.2(GND) X2.1
NetC14_1: C14.1 C15.1 L3.1 U9.3(Vout)
NetC27_1: C27.1 C39.1 L2.1 U10.1(VDC)
NetC28_1: C28.1 C40.1 D1.2(A) L2.2
NetD2_2: D2.2(A) X2.2
NetD3_1: D3.1(K) L4.4 U10.4(VA1+)
NetD3_2: D3.2(A) L4.3 U10.5(VA2-)
NetJ1_9: L4.2 ; port +PWR
NetJ1_10: L4.1 ; port -PWR

Not connected (* = marked no-connect by the designer): U10 3(ADJ)

### Notes on the sheet
- MMC_2_4_PSU
- PN10027
- 3/3
- 2.4
- Sebastian Kulik

### Library data of the parts
C13 C15 C36 = 100nF25V_0402: as C21 on sheet MMC_2_4_Ethernet; Published: 09.12.2014; Part Description: AVX, X5R, 10%, 25V; Publisher: Sebastian Kulik; PackageDescription: C0402; Manufacturer: AVX
C14 C27 C40 = 470uF25V_POL_FT: Panasonic, FT series; Deliverer PartNr: 1868411; Manufacturer PartNr: EEEFT1E471AP; Deliverer: Farnell; TDE-PN: C0048; Published: 23.09.2014; Part Description: Panasonic, FT series; Publisher: Sebastian Kulik; PackageDescription: Panasonic-FT-F; Manufacturer: Panasonic
C28 = 10uF50V_1210: AVX,  X7R, 10%, 50V; Deliverer PartNr: 2094047RL; Manufacturer PartNr: 12105C106KAT2A; Deliverer: Farnell; TDE-PN: C0039; Published: 17.02.2014; Part Description: AVX,  X7R, 10%, 50V; Publisher: Sebastian Kulik; PackageDescription: C1210; Manufacturer: AVX
C35 = 10uF25V_1210: TDK  C series, X5R, 10%, 25V; Deliverer PartNr: 2346957; Manufacturer PartNr: C3225X5R1E106K250AA; Deliverer: Farnell; TDE-PN: C0014; Published: 12.02.2014; Part Description: TDK  C series, X5R, 10%, 25V; Publisher: Sebastian Kulik; PackageDescription: C1210; Manufacturer: TDK
C39 = 10uF_20V_V293D-B: as C30 on sheet MMC_2_4_Ethernet; Published: 14.03.2014; Publisher: Sebastian Kulik; PackageDescription: Vishay-293D-B
C41 = 100uF_6V3_V293D-B: 293 series, tantal, 10%, 6.3V; Deliverer PartNr: 1754153; Manufacturer: Vishay; Manufacturer PartNr: 293D107X96R3B2TE3; Deliverer: Farnell; TDE-PN: C0028; Published: 11.03.2014; Part Description: 293 series, tantal, 10%, 6.3V; Publisher: Sebastian Kulik; PackageDescription: Vishay293D-B
D1 D2 = RB160M-30TR: Diode Schottky,2A,40V; Deliverer PartNr: 1525480; Manufacturer: Rohm; TDE-PN: DIS0010; Deliverer: Farnell; Published: 17.02.2014; Publisher: Sebastian Kulik; PackageDescription: SOD123; Manufacturer PartNr: RB160M-30TR
D3 = SMAJ58A-E3/61: TVS, 400W, 58V; Deliverer PartNr: 1837053; Manufacturer: Vishay; TDE-PN: DIS0009; Deliverer: Farnell; Published: 17.02.2014; Publisher: Sebastian Kulik; PackageDescription: DO214AC; Manufacturer PartNr: SMAJ58A-E3/61
L2 = 10uH2A_WE-PD2: WE-PD2, 10uH2A; Deliverer PartNr: 74477510; Deliverer: WE; TDE-PN: P0017; Manufacturer: WE; Manufacturer PartNr: 74477510; Published: 17.02.2014; Publisher: Sebastian Kulik; Value: 10uH2A; PackageDescription: WE-PD2_1
L3 = 300R2A_0603: WE, Ferrit, 300Rx2A; Deliverer PartNr: 742792641; TDE-PN: P0021; Deliverer: WE; Manufacturer: WE; Manufacturer PartNr: 742792641; Published: 26.05.2014; Publisher: Sebastian Kulik; PackageDescription: L0603
L4 = 1000R1A-SCC: Common mode choke; Deliverer PartNr: 744281100; Deliverer: WE; TDE-PN: P0034; Manufacturer: WE; Manufacturer PartNr: 744281100; Published: 30.01.2015; Publisher: Sebastian Kulik; PackageDescription: WE-CMS; Value: 1000R1A-SCC
U9 = Recom-R-783_3-0_5: Voltage Regulator; Manufacturer: Recom; Deliverer PartNr: 532-8044; TDE-PN: IC0032; Deliverer: RS-Components; Published: 12.02.2014; Manufacturer PartNr: R-783.3-0.5; Publisher: Sebastian Kulik; PackageDescription: R-783_3-0_5/D-PACK
U10 = AG-9812M: PoE, 12V; Manufacturer: Silvertel; Deliverer: Codico; TDE-PN: IC0052; Published: 17.02.2014; Deliverer PartNr: AG-9812M; Publisher: Sebastian Kulik; Manufacturer PartNr: AG-9812M; PackageDescription: AG9812M
X2 = Header-2-WR-TBL3127: as X4 on sheet MMC_2_4_Ethernet; LatestRevisionDate: 28.05.2014; LatestRevisionNote: Re-released for DXP Platform.; Publisher: Sebastian Kulik; PackageDescription: WR-TBL-3127

## Nets that join several sheets
3V3: MMC_2_4_MCU (25 pins), MMC_2_4_Ethernet (12 pins), MMC_2_4_PSU (C35.1 C36.1 C41.1 L3.2)
12V: MMC_2_4_MCU (JP1.9), MMC_2_4_Ethernet (5 pins), MMC_2_4_PSU (C13.1 D1.1 D2.1 U9.1)
GND: MMC_2_4_MCU (21 pins), MMC_2_4_Ethernet (36 pins), MMC_2_4_PSU (13 pins)
NetJ1_9: MMC_2_4_Ethernet (J1.9), MMC_2_4_PSU (L4.2)
NetJ1_10: MMC_2_4_Ethernet (J1.10), MMC_2_4_PSU (L4.1)
NetL5_2: MMC_2_4_MCU (U1.63), MMC_2_4_Ethernet (L5.2)
NetR13_1: MMC_2_4_MCU (U1.49), MMC_2_4_Ethernet (R13.1 U7.16)
NetR15_2: MMC_2_4_MCU (U1.60), MMC_2_4_Ethernet (R15.2)
NetR16_2: MMC_2_4_MCU (U1.61), MMC_2_4_Ethernet (R16.2)
NetR17_2: MMC_2_4_MCU (U1.64), MMC_2_4_Ethernet (R17.2)
NetR18_2: MMC_2_4_MCU (U1.62), MMC_2_4_Ethernet (R18.2)
NetU1_1: MMC_2_4_MCU (U1.1), MMC_2_4_Ethernet (U7.21)
NetU1_2: MMC_2_4_MCU (U1.2), MMC_2_4_Ethernet (U7.22)
NetU1_3: MMC_2_4_MCU (U1.3), MMC_2_4_Ethernet (U7.23)
NetU1_4: MMC_2_4_MCU (U1.4), MMC_2_4_Ethernet (U11.10)
NetU1_5: MMC_2_4_MCU (U1.5), MMC_2_4_Ethernet (U11.12)
NetU1_6: MMC_2_4_MCU (U1.6), MMC_2_4_Ethernet (U11.11)
NetU1_8: MMC_2_4_MCU (U1.8), MMC_2_4_Ethernet (U11.9)
NetU1_23: MMC_2_4_MCU (U1.23), MMC_2_4_Ethernet (U6.6)
NetU1_24: MMC_2_4_MCU (U1.24), MMC_2_4_Ethernet (U6.8)
NetU1_30: MMC_2_4_MCU (U1.30), MMC_2_4_Ethernet (U7.17)
NetU1_46: MMC_2_4_MCU (U1.46), MMC_2_4_Ethernet (U6.1)
NetU1_47: MMC_2_4_MCU (U1.47), MMC_2_4_Ethernet (U6.4)
NetU1_48: MMC_2_4_MCU (U1.48), MMC_2_4_Ethernet (U6.2)
NetU1_50: MMC_2_4_MCU (U1.50), MMC_2_4_Ethernet (U6.7)
NetU1_51: MMC_2_4_MCU (U1.51), MMC_2_4_Ethernet (U6.5)
NetU1_52: MMC_2_4_MCU (U1.52), MMC_2_4_Ethernet (U6.3)

## Assembly variants
MMC_2_4: not fitted JP1 JP2 JP3